# EAGLE design litefury5-final (EAGLE 6.5.0)
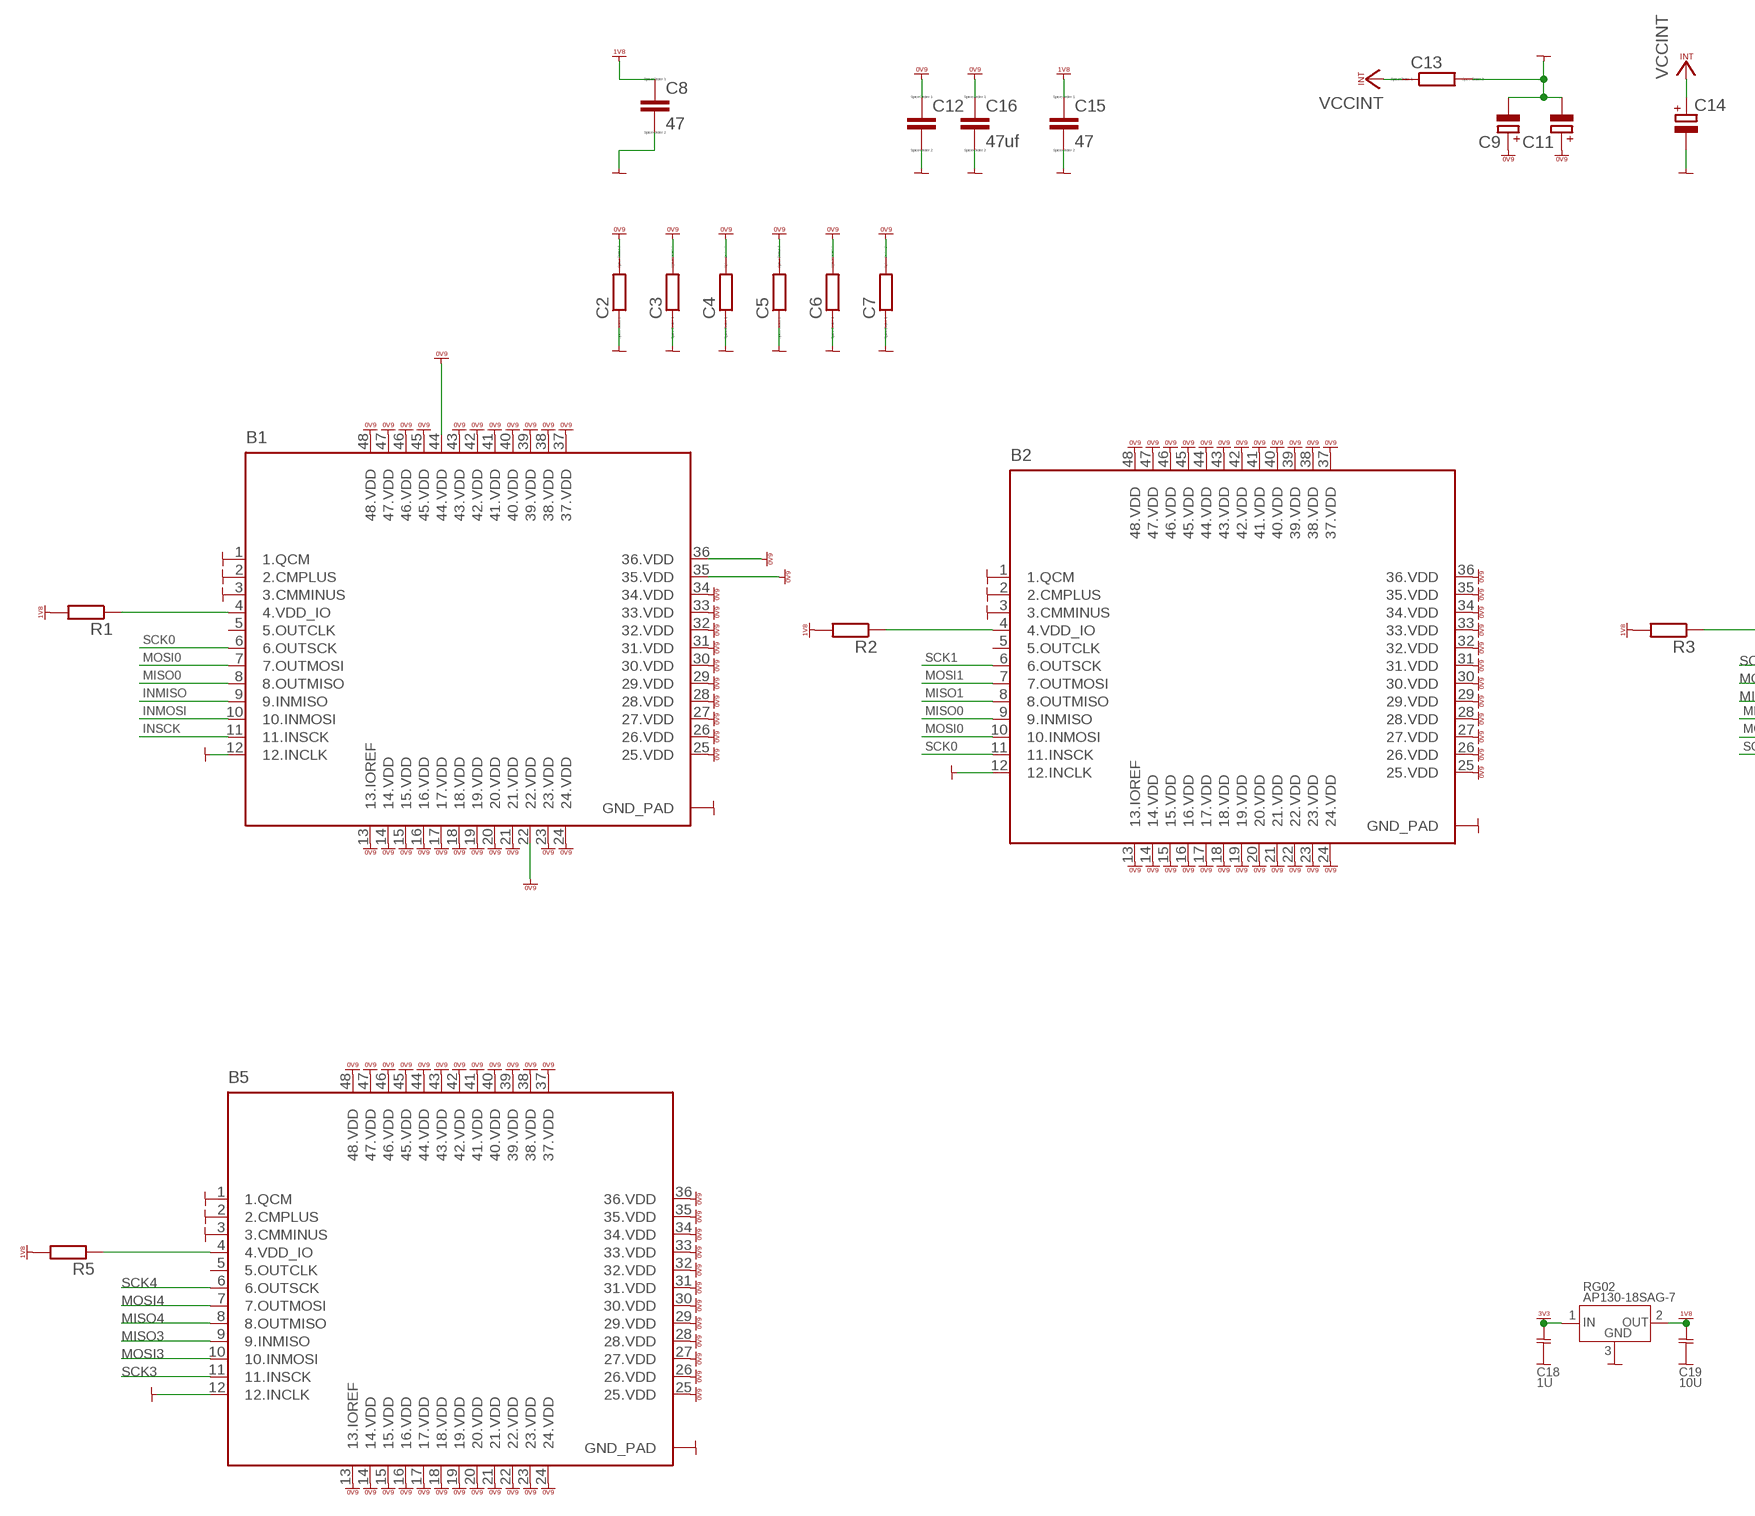
[diagram p0: schematic, sheet 1, part 1 of 2]
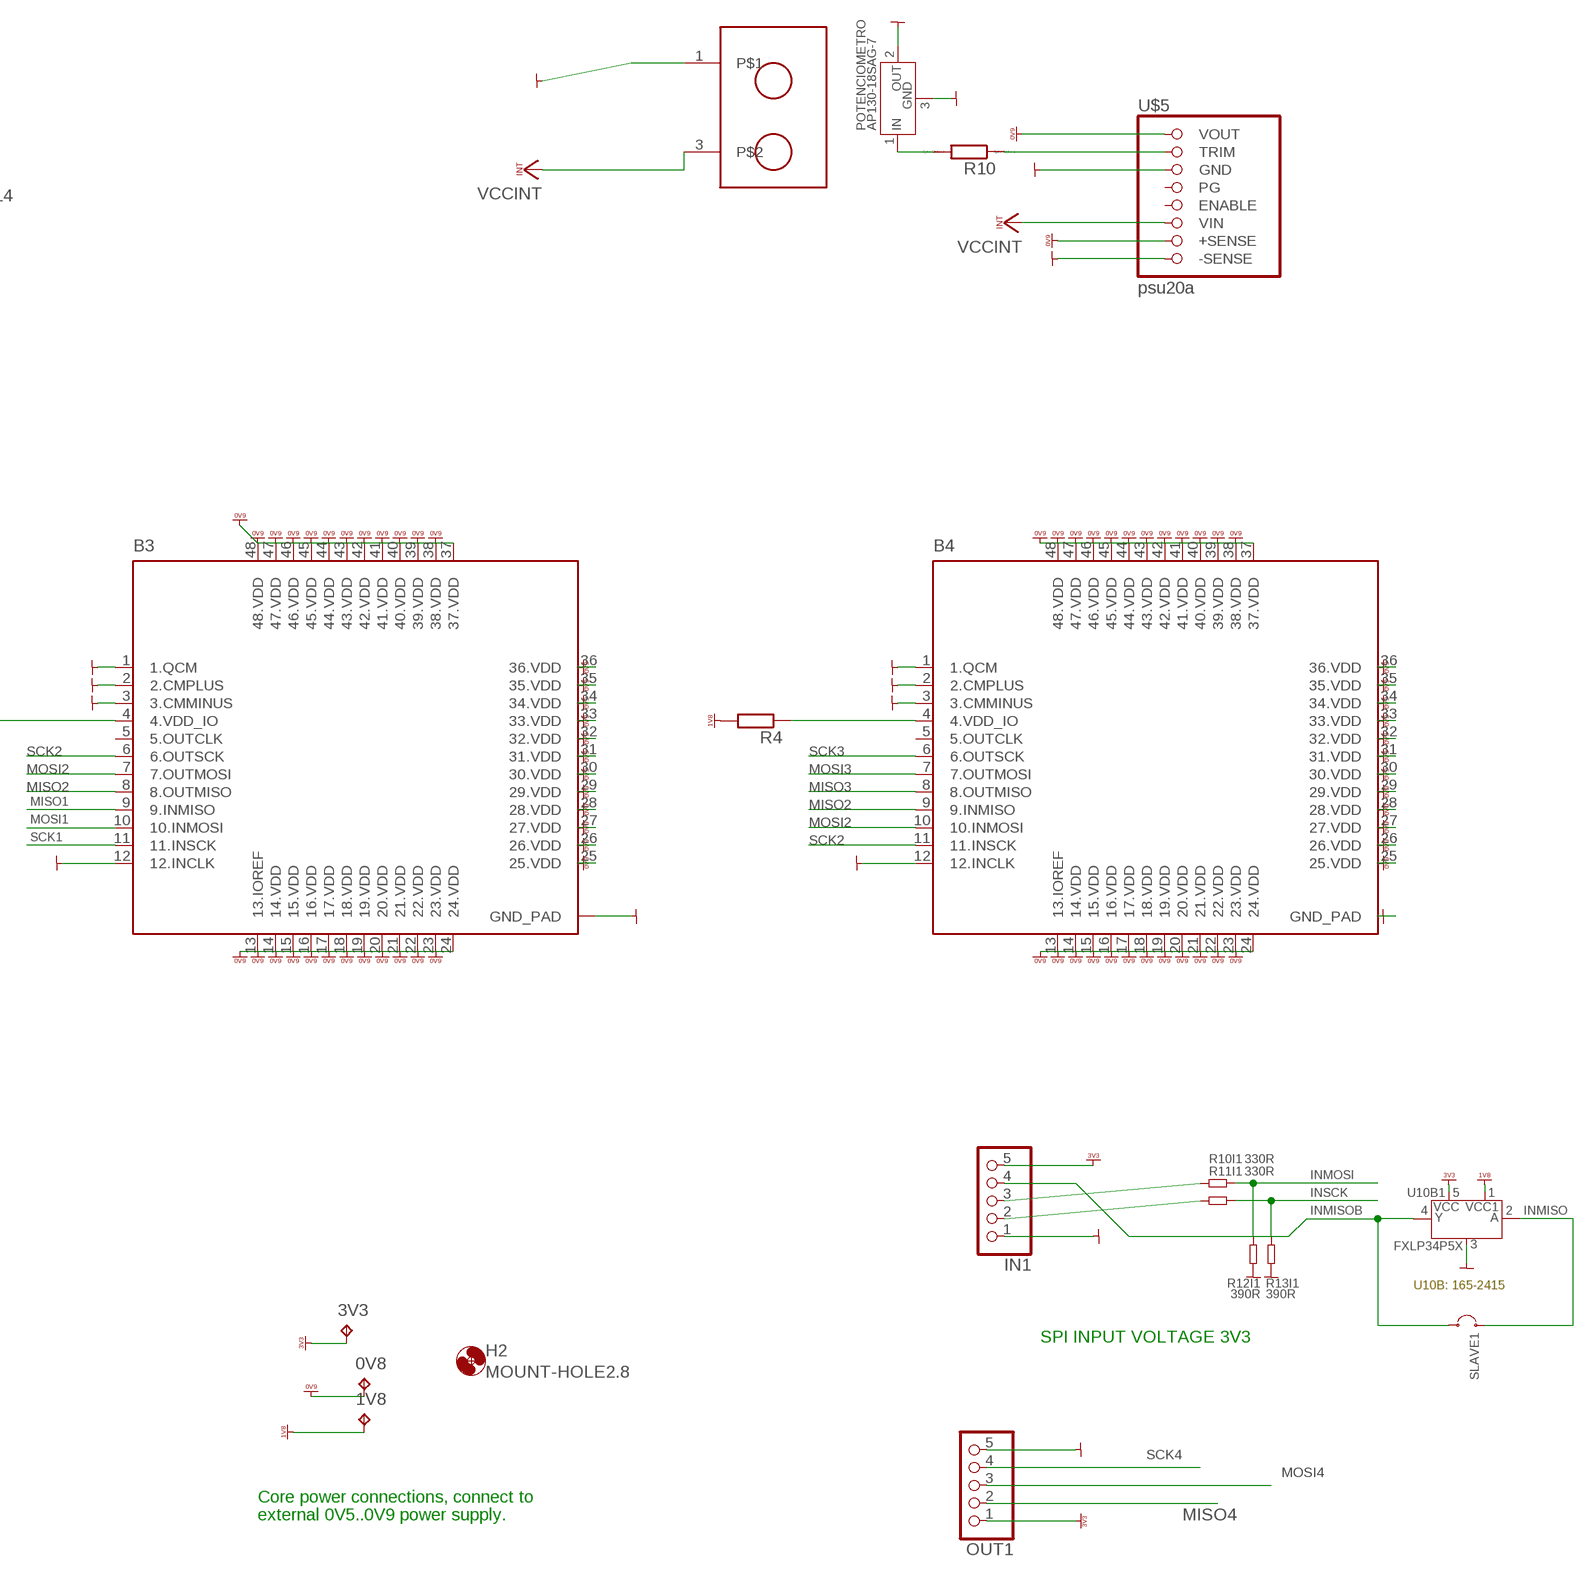
[diagram p1: schematic, sheet 1, part 2 of 2]

## Parts
0V8  TPTP14SQ  [TP14SQ]
1V8  TPTP10SQ  [TP10SQ]
3V3  TPTP14SQ  [TP14SQ]
B1  BITFURYM  [QFN48]
B2  BITFURYM  [QFN48]
B3  BITFURYM  [QFN48]
B4  BITFURYM  [QFN48]
B5  BITFURYM  [QFN48]
C2  RR2010  [R2010]
C3  RR2010  [R2010]
C4  RR2010  [R2010]
C5  RR2010  [R2010]
C6  RR2010  [R2010]
C7  RR2010  [R2010]
C8  47  CC1210  [C1210]
C9  CPOL-EUCT7343  [CT7343]
C11  CPOL-EUCT7343  [CT7343]
C12  CC1210  [C1210]
C13  RR2010  [R2010]
C14  CPOL-EUCT7343  [CT7343]
C15  47  CC1210  [C1210]
C16  47uf  CC1210  [C1210]
C18  1U  CAP0603  [CAP0603]
C19  10U  CAP0603  [CAP0603]
H2  MOUNT-HOLE2.8  [2,8]
IN1  PINHD-1X5/90  [1X05/90]
OUT1  PINHD-1X5/90  [1X05/90]
POTENCIOMETRO  AP130-18SAG-7  [SOT23]
R1  R-EU_R1206  [R1206]
R2  R-EU_R1206  [R1206]
R3  R-EU_R1206  [R1206]
R4  R-EU_R1206  [R1206]
R5  R-EU_R1206  [R1206]
R10  RR0603  [R0603]
R10I1  330R  RES0603  [RES0603]
R11I1  330R  RES0603  [RES0603]
R12I1  390R  RES0603  [RES0603]
R13I1  390R  RES0603  [RES0603]
RG02  AP130-18SAG-7  [SOT23]
SLAVE1  SJ2SJ2-S  [SJ2-S]
U10B1  FXLP34P5X  [SOT23-5]
U$5  D12S05020  [PSU20A]
U$6  RTORNILLO  [REGLETATORNILLO]

## Nets
GND: B1.1(1.QCM) B1.2(2.CMPLUS) B1.3(3.CMMINUS) B1.12(12.INCLK) B1.EXP(GND_PAD) B1.P$1(GND_PAD) B1.P$2(GND_PAD) B1.P$3(GND_PAD) B1.P$4(GND_PAD) B1.P$5(GND_PAD) B1.P$6(GND_PAD) B1.P$7(GND_PAD) B1.P$8(GND_PAD) B1.P$9(GND_PAD) B1.P$10(GND_PAD) B1.P$11(GND_PAD) B1.P$12(GND_PAD) B1.P$13(GND_PAD) B1.P$14(GND_PAD) B1.P$15(GND_PAD) B1.P$16(GND_PAD) B1.P$17(GND_PAD) B1.P$18(GND_PAD) B1.P$19(GND_PAD) B1.P$20(GND_PAD) B1.P$21(GND_PAD) B1.P$22(GND_PAD) B1.P$23(GND_PAD) B1.P$24(GND_PAD) B1.P$25(GND_PAD) B2.1(1.QCM) B2.2(2.CMPLUS) B2.3(3.CMMINUS) B2.12(12.INCLK) B2.EXP(GND_PAD) B2.P$1(GND_PAD) B2.P$2(GND_PAD) B2.P$3(GND_PAD) B2.P$4(GND_PAD) B2.P$5(GND_PAD) B2.P$6(GND_PAD) B2.P$7(GND_PAD) B2.P$8(GND_PAD) B2.P$9(GND_PAD) B2.P$10(GND_PAD) B2.P$11(GND_PAD) B2.P$12(GND_PAD) B2.P$13(GND_PAD) B2.P$14(GND_PAD) B2.P$15(GND_PAD) B2.P$16(GND_PAD) B2.P$17(GND_PAD) B2.P$18(GND_PAD) B2.P$19(GND_PAD) B2.P$20(GND_PAD) B2.P$21(GND_PAD) B2.P$22(GND_PAD) B2.P$23(GND_PAD) B2.P$24(GND_PAD) B2.P$25(GND_PAD) B3.1(1.QCM) B3.2(2.CMPLUS) B3.3(3.CMMINUS) B3.12(12.INCLK) B3.EXP(GND_PAD) B3.P$1(GND_PAD) B3.P$2(GND_PAD) B3.P$3(GND_PAD) B3.P$4(GND_PAD) B3.P$5(GND_PAD) B3.P$6(GND_PAD) B3.P$7(GND_PAD) B3.P$8(GND_PAD) B3.P$9(GND_PAD) B3.P$10(GND_PAD) B3.P$11(GND_PAD) B3.P$12(GND_PAD) B3.P$13(GND_PAD) B3.P$14(GND_PAD) B3.P$15(GND_PAD) B3.P$16(GND_PAD) B3.P$17(GND_PAD) B3.P$18(GND_PAD) B3.P$19(GND_PAD) B3.P$20(GND_PAD) B3.P$21(GND_PAD) B3.P$22(GND_PAD) B3.P$23(GND_PAD) B3.P$24(GND_PAD) B3.P$25(GND_PAD) B4.1(1.QCM) B4.2(2.CMPLUS) B4.3(3.CMMINUS) B4.12(12.INCLK) B4.EXP(GND_PAD) B4.P$1(GND_PAD) B4.P$2(GND_PAD) B4.P$3(GND_PAD) B4.P$4(GND_PAD) B4.P$5(GND_PAD) B4.P$6(GND_PAD) B4.P$7(GND_PAD) B4.P$8(GND_PAD) B4.P$9(GND_PAD) B4.P$10(GND_PAD) B4.P$11(GND_PAD) B4.P$12(GND_PAD) B4.P$13(GND_PAD) B4.P$14(GND_PAD) B4.P$15(GND_PAD) B4.P$16(GND_PAD) B4.P$17(GND_PAD) B4.P$18(GND_PAD) B4.P$19(GND_PAD) B4.P$20(GND_PAD) B4.P$21(GND_PAD) B4.P$22(GND_PAD) B4.P$23(GND_PAD) B4.P$24(GND_PAD) B4.P$25(GND_PAD) B5.1(1.QCM) B5.2(2.CMPLUS) B5.3(3.CMMINUS) B5.12(12.INCLK) B5.EXP(GND_PAD) B5.P$1(GND_PAD) B5.P$2(GND_PAD) B5.P$3(GND_PAD) B5.P$4(GND_PAD) B5.P$5(GND_PAD) B5.P$6(GND_PAD) B5.P$7(GND_PAD) B5.P$8(GND_PAD) B5.P$9(GND_PAD) B5.P$10(GND_PAD) B5.P$11(GND_PAD) B5.P$12(GND_PAD) B5.P$13(GND_PAD) B5.P$14(GND_PAD) B5.P$15(GND_PAD) B5.P$16(GND_PAD) B5.P$17(GND_PAD) B5.P$18(GND_PAD) B5.P$19(GND_PAD) B5.P$20(GND_PAD) B5.P$21(GND_PAD) B5.P$22(GND_PAD) B5.P$23(GND_PAD) B5.P$24(GND_PAD) B5.P$25(GND_PAD) C2.1 C3.1 C4.1 C5.1 C6.1 C7.1 C8.2 C9.- C11.- C12.2 C13.2 C14.- C15.2 C16.2 C18.2 C19.2 IN1.1 OUT1.5 POTENCIOMETRO.2(2.OUT) POTENCIOMETRO.3(3.GND) R12I1.1 R13I1.1 RG02.3(3.GND) U10B1.3(3.GND) U$5.3(GND) U$5.8(-SENSE) U$6.1
INMISO: B1.9(9.INMISO) SLAVE1.2 U10B1.2(2.A)
INMISOB: IN1.4 SLAVE1.1 U10B1.4(4.Y)
INMOSI: B1.10(10.INMOSI) R10I1.2 R12I1.2
INSCK: B1.11(11.INSCK) R11I1.2 R13I1.2
MISO0: B1.8(8.OUTMISO) B2.9(9.INMISO)
MISO1: B2.8(8.OUTMISO) B3.9(9.INMISO)
MISO2: B3.8(8.OUTMISO) B4.9(9.INMISO)
MISO3: B4.8(8.OUTMISO) B5.9(9.INMISO)
MISO4: B5.8(8.OUTMISO) OUT1.2
MOSI0: B1.7(7.OUTMOSI) B2.10(10.INMOSI)
MOSI1: B2.7(7.OUTMOSI) B3.10(10.INMOSI)
MOSI2: B3.7(7.OUTMOSI) B4.10(10.INMOSI)
MOSI3: B4.7(7.OUTMOSI) B5.10(10.INMOSI)
MOSI4: B5.7(7.OUTMOSI) OUT1.3
N$1: B1.4(4.VDD_IO) R1.1
N$2: B2.4(4.VDD_IO) R2.1
N$3: B3.4(4.VDD_IO) R3.1
N$4: B4.4(4.VDD_IO) R4.1
N$5: B5.4(4.VDD_IO) R5.1
N$6: POTENCIOMETRO.1(1.IN) R10.2
N$10: R10.1 U$5.2(TRIM)
N$12: IN1.2 R11I1.1
N$13: IN1.3 R10I1.1
SCK0: B1.6(6.OUTSCK) B2.11(11.INSCK)
SCK1: B2.6(6.OUTSCK) B3.11(11.INSCK)
SCK2: B3.6(6.OUTSCK) B4.11(11.INSCK)
SCK3: B4.6(6.OUTSCK) B5.11(11.INSCK)
SCK4: B5.6(6.OUTSCK) OUT1.4
VCCINT: C13.1 C14.+ U$5.6(VIN) U$6.3
VDD_0V9: 0V8.TP B1.13(13.IOREF) B1.14(14.VDD) B1.15(15.VDD) B1.16(16.VDD) B1.17(17.VDD) B1.18(18.VDD) B1.19(19.VDD) B1.20(20.VDD) B1.21(21.VDD) B1.22(22.VDD) B1.23(23.VDD) B1.24(24.VDD) B1.25(25.VDD) B1.26(26.VDD) B1.27(27.VDD) B1.28(28.VDD) B1.29(29.VDD) B1.30(30.VDD) B1.31(31.VDD) B1.32(32.VDD) B1.33(33.VDD) B1.34(34.VDD) B1.35(35.VDD) B1.36(36.VDD) B1.37(37.VDD) B1.38(38.VDD) B1.39(39.VDD) B1.40(40.VDD) B1.41(41.VDD) B1.42(42.VDD) B1.43(43.VDD) B1.44(44.VDD) B1.45(45.VDD) B1.46(46.VDD) B1.47(47.VDD) B1.48(48.VDD) B2.13(13.IOREF) B2.14(14.VDD) B2.15(15.VDD) B2.16(16.VDD) B2.17(17.VDD) B2.18(18.VDD) B2.19(19.VDD) B2.20(20.VDD) B2.21(21.VDD) B2.22(22.VDD) B2.23(23.VDD) B2.24(24.VDD) B2.25(25.VDD) B2.26(26.VDD) B2.27(27.VDD) B2.28(28.VDD) B2.29(29.VDD) B2.30(30.VDD) B2.31(31.VDD) B2.32(32.VDD) B2.33(33.VDD) B2.34(34.VDD) B2.35(35.VDD) B2.36(36.VDD) B2.37(37.VDD) B2.38(38.VDD) B2.39(39.VDD) B2.40(40.VDD) B2.41(41.VDD) B2.42(42.VDD) B2.43(43.VDD) B2.44(44.VDD) B2.45(45.VDD) B2.46(46.VDD) B2.47(47.VDD) B2.48(48.VDD) B3.13(13.IOREF) B3.14(14.VDD) B3.15(15.VDD) B3.16(16.VDD) B3.17(17.VDD) B3.18(18.VDD) B3.19(19.VDD) B3.20(20.VDD) B3.21(21.VDD) B3.22(22.VDD) B3.23(23.VDD) B3.24(24.VDD) B3.25(25.VDD) B3.26(26.VDD) B3.27(27.VDD) B3.28(28.VDD) B3.29(29.VDD) B3.30(30.VDD) B3.31(31.VDD) B3.32(32.VDD) B3.33(33.VDD) B3.34(34.VDD) B3.35(35.VDD) B3.36(36.VDD) B3.37(37.VDD) B3.38(38.VDD) B3.39(39.VDD) B3.40(40.VDD) B3.41(41.VDD) B3.42(42.VDD) B3.43(43.VDD) B3.44(44.VDD) B3.45(45.VDD) B3.46(46.VDD) B3.47(47.VDD) B3.48(48.VDD) B4.13(13.IOREF) B4.14(14.VDD) B4.15(15.VDD) B4.16(16.VDD) B4.17(17.VDD) B4.18(18.VDD) B4.19(19.VDD) B4.20(20.VDD) B4.21(21.VDD) B4.22(22.VDD) B4.23(23.VDD) B4.24(24.VDD) B4.25(25.VDD) B4.26(26.VDD) B4.27(27.VDD) B4.28(28.VDD) B4.29(29.VDD) B4.30(30.VDD) B4.31(31.VDD) B4.32(32.VDD) B4.33(33.VDD) B4.34(34.VDD) B4.35(35.VDD) B4.36(36.VDD) B4.37(37.VDD) B4.38(38.VDD) B4.39(39.VDD) B4.40(40.VDD) B4.41(41.VDD) B4.42(42.VDD) B4.43(43.VDD) B4.44(44.VDD) B4.45(45.VDD) B4.46(46.VDD) B4.47(47.VDD) B4.48(48.VDD) B5.13(13.IOREF) B5.14(14.VDD) B5.15(15.VDD) B5.16(16.VDD) B5.17(17.VDD) B5.18(18.VDD) B5.19(19.VDD) B5.20(20.VDD) B5.21(21.VDD) B5.22(22.VDD) B5.23(23.VDD) B5.24(24.VDD) B5.25(25.VDD) B5.26(26.VDD) B5.27(27.VDD) B5.28(28.VDD) B5.29(29.VDD) B5.30(30.VDD) B5.31(31.VDD) B5.32(32.VDD) B5.33(33.VDD) B5.34(34.VDD) B5.35(35.VDD) B5.36(36.VDD) B5.37(37.VDD) B5.38(38.VDD) B5.39(39.VDD) B5.40(40.VDD) B5.41(41.VDD) B5.42(42.VDD) B5.43(43.VDD) B5.44(44.VDD) B5.45(45.VDD) B5.46(46.VDD) B5.47(47.VDD) B5.48(48.VDD) C2.2 C3.2 C4.2 C5.2 C6.2 C7.2 C9.+ C11.+ C12.1 C16.1 U$5.1(VOUT) U$5.7(+SENSE) ; supply symbol labelled VCC_0V9
VDD_1V8: 1V8.TP C8.1 C15.1 C19.1 R1.2 R2.2 R3.2 R4.2 R5.2 RG02.2(2.OUT) U10B1.1(1.VCC1) ; supply symbol labelled VCC_1V8
VDD_3V3: 3V3.TP C18.1 IN1.5 OUT1.1 RG02.1(1.IN) U10B1.5(5.VCC) ; supply symbol labelled VCC_3V3
Unconnected: B1.5(5.OUTCLK) B2.5(5.OUTCLK) B3.5(5.OUTCLK) B4.5(5.OUTCLK) B5.5(5.OUTCLK) U$5.4(PG) U$5.5(ENABLE)

## Notes on the sheet
- U10B: 165-2415
- SPI INPUT VOLTAGE 3V3
- Core power connections, connect to
- external 0V5..0V9 power supply.

## Library data of the parts
0V8 1V8 3V3 = testpad:TP: Test pad
B1-B5 = BITF:BITFURYM
C2-C7 C13 R10 = eagle-ltspice:R: RESISTOR, European symbol; SPICEMODEL: NONE; SPICEPREFIX: R
C8 C12 C15 C16 = eagle-ltspice:C: CAPACITOR, European symbol; SPICEMODEL: NONE; SPICEPREFIX: C
C9 C11 C14 = rcl:CPOL-EU: POLARIZED CAPACITOR, European symbol
C18 C19 = 00-own_parts:CAP0603
H2 = holes:MOUNT-HOLE: MOUNTING HOLE with drill center marker
IN1 OUT1 = pinhead:PINHD-1X5: PIN HEADER
POTENCIOMETRO RG02 = 00-bitfury:AP130-18SAG-7: Regulator, 300mA, Vdrop: 400mV, Vin_max: 5V5, Vout: 1V8, SOT23, F#182-5304
R1-R5 = rcl:R-EU_: RESISTOR, European symbol
R10I1 R11I1 R12I1 R13I1 = 00-own_parts:RES
SLAVE1 = 00-own_parts:SJ2
U10B1 = 00-bitfury:FXLP34P5X: Buffer, level shifting, single gate, SOT23-5, F#165-2415
U$5 = BITF:D12S05020
U$6 = BITF:RTORNILLO

## Board
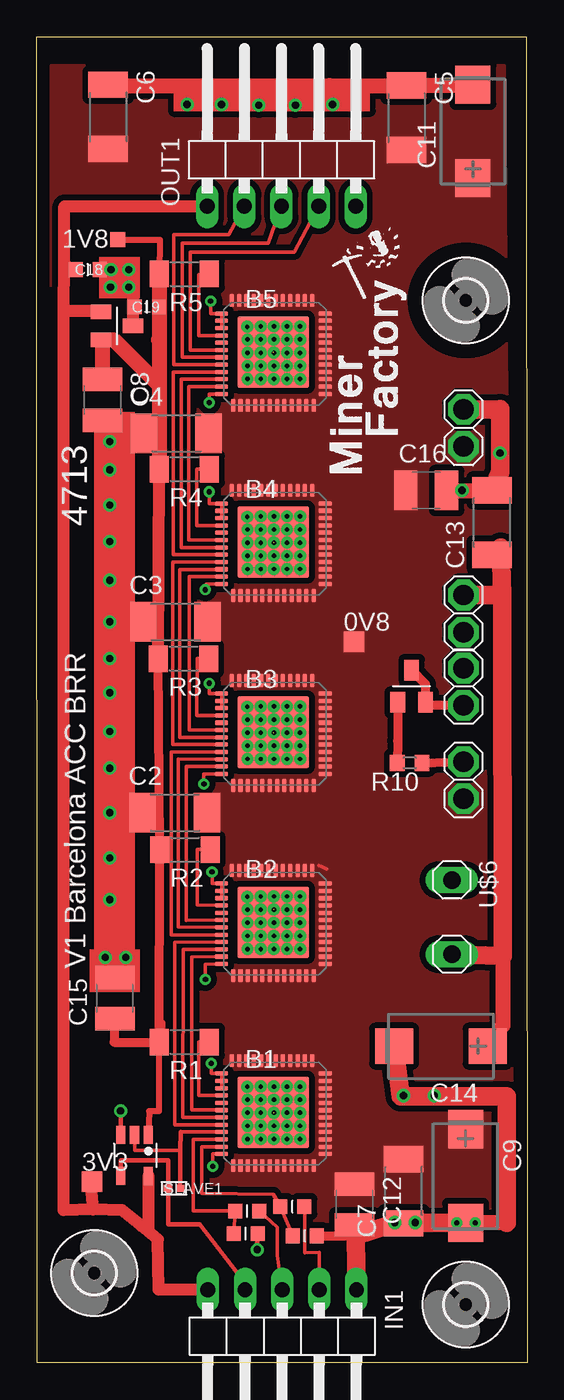
[diagram p2: board, top side]
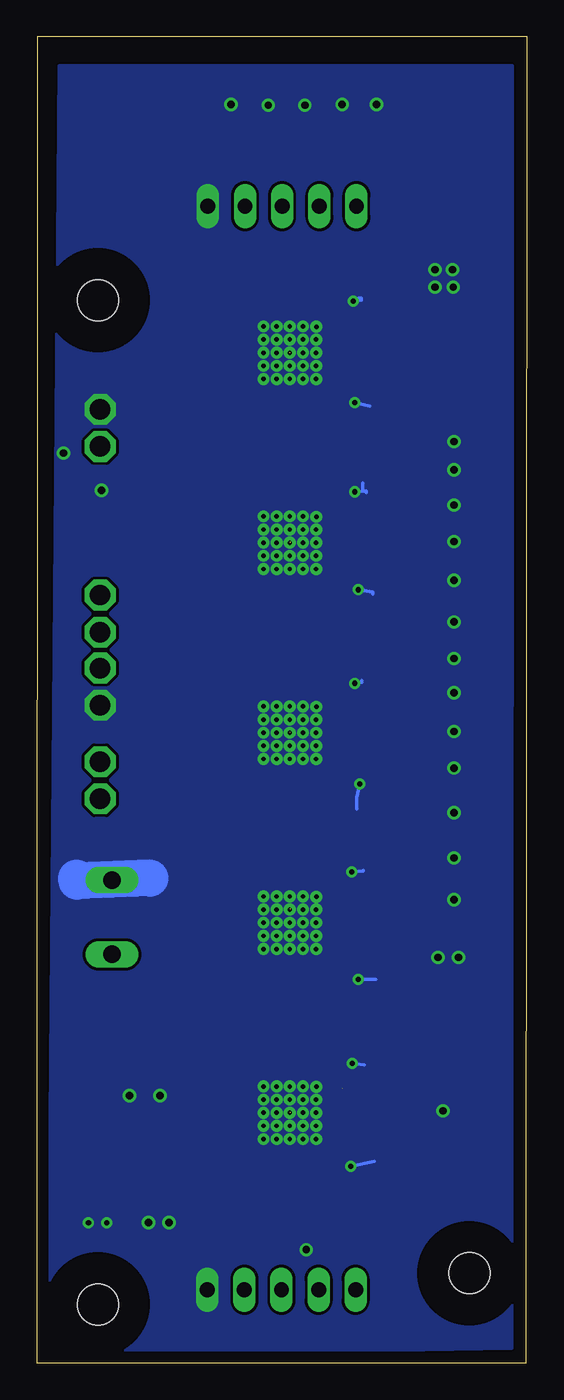
[diagram p3: board, bottom side, seen from below]

Size 33.55 x 90.75 mm. Coordinates in mm from the lower left corner, seen from the top.
Outline: 0,90.75 33.5,90.75 33.55,0 0.05,0 0,90.75
Copper layers (1*16): Top 0.035mm / dielectric 1.5mm / Bottom 0.035mm
Design rules "default *": minimum track width 10mil, minimum drill 24mil, track to track 8mil, track to pad 8mil, pad to pad 8mil, via to via 8mil, smd to smd 8mil, copper to edge 30mil, drill to drill 12mil, minimum pad ring 10mil, minimum via ring 8mil, stop-mask expansion 4mil, vias tented up to drill 0mil, thermal gap 10mil

### Footprints (pad centres in the part's own frame; a part is rotated, then mirrored left to right if it is on the bottom)
TP14SQ = smd 1.4 x 1.4: TP 0,0
TP10SQ = smd 1 x 1: TP 0,0
QFN48 = smd 0.889 x 0.3: 1 3.645,-2.75; 2 3.645,-2.25; 3 3.645,-1.75; 4 3.645,-1.25; 5 3.645,-0.75; 6 3.645,-0.25; 7 3.645,0.25; 8 3.645,0.75; 9 3.645,1.25; 10 3.645,1.75; 11 3.645,2.25; 12 3.645,2.75; 25 -3.444,2.75; 26 -3.444,2.25; 27 -3.444,1.75; 28 -3.444,1.25; 29 -3.444,0.75; 30 -3.444,0.25; 31 -3.444,-0.25; 32 -3.444,-0.75; 33 -3.444,-1.25; 34 -3.444,-1.75; 35 -3.444,-2.25; 36 -3.444,-2.75 | smd 0.3 x 0.889: 13 2.85,3.544; 14 2.35,3.544; 15 1.85,3.544; 16 1.35,3.544; 17 0.85,3.544; 18 0.35,3.544; 19 -0.15,3.544; 20 -0.65,3.544; 21 -1.15,3.544; 22 -1.65,3.544; 23 -2.15,3.544; 24 -2.65,3.544; 37 -2.55,-3.644; 38 -2.05,-3.644; 39 -1.55,-3.644; 40 -1.05,-3.644; 41 -0.55,-3.644; 42 -0.05,-3.644; 43 0.45,-3.644; 44 0.95,-3.644; 45 1.45,-3.644; 46 1.95,-3.644; 47 2.45,-3.644; 48 2.95,-3.644 | smd 4.9 x 4.9: EXP 0.1,-0.1 | drill 0.3: P$1 1.887,-1.845; P$2 0.97,-1.87; P$3 0.07,-1.87; P$4 -0.83,-1.87; P$5 -1.73,-1.87; P$6 1.87,-0.97; P$7 0.97,-0.97; P$8 0.07,-0.97; P$9 -0.83,-0.97; P$10 -1.73,-0.97; P$11 1.87,-0.07; P$12 0.97,-0.07; P$13 0.07,-0.07; P$14 -0.83,-0.07; P$15 -1.73,-0.07; P$16 1.87,0.83; P$17 0.97,0.83; P$18 0.07,0.83; P$19 -0.83,0.83; P$20 -1.73,0.83; P$21 1.87,1.73; P$22 0.97,1.73; P$23 0.07,1.73; P$24 -0.83,1.73; P$25 -1.73,1.73
R2010 = smd 1.8 x 2.7: 1 -2.2,0; 2 2.2,0
C1210 = smd 1.6 x 2.7: 1 -1.4,0; 2 1.4,0
CT7343 = smd 2.6 x 2.4: + -3.2,0; - 3.2,0
CAP0603 = smd 0.95 x 1: 1 -0.821,0.002; 2 0.822,0
2,8 = hole 2.8: 0,0
1X05/90 = drill 1.016 long: 1 -5.08,-3.81; 2 -2.54,-3.81; 3 0,-3.81; 4 2.54,-3.81; 5 5.08,-3.81
SOT23 = smd 1 x 1.4: 1 -0.95,-1.1; 2 0.95,-1.1; 3 0,1.1
R1206 = smd 1.3 x 1.803: 1 -1.722,0; 2 1.722,0
R0603 = smd 1 x 1.1: 1 -0.85,0; 2 0.85,0
RES0603 = smd 0.95 x 1: 1 -0.821,0.002; 2 0.822,0
SJ2-S = smd 0.6 x 0.5: 1 -0.41,0; 2 0.41,0
SOT23-5 = smd 0.62 x 1.22: 1 -0.95,-1.4; 2 0,-1.4; 3 0.95,-1.4; 4 0.95,1.4; 5 -0.95,1.4
PSU20A = drill 1.4 octagon: 1 12.5,0.1; 2 9.96,0.1; 3 6.1,0.1; 4 3.56,0.1; 5 1.1,0.1; 6 -1.44,0.1; 7 -11.6,0.1; 8 -14.14,0.1
REGLETATORNILLO = drill 1.2 long: 1 -2.54,0; 3 2.54,0

### Placement (x,y rotation side)
0V8  21.7,49.35 0 top
1V8  5.55,76.85 0 top
3V3  3.8,12.4 0 top
B1  16.3,17.05 180 top
B2  16.3,30.05 180 top
B3  16.3,43.05 180 top
B4  16.3,56.05 180 top
B5  16.3,69.05 180 top
C2  9.45,37.65 0 top
C3  9.5,50.7 0 top
C4  9.55,63.6 0 top
C5  25.3,85.2 270 top
C6  4.9,85.25 270 top
C7  25.1,11.75 90 top
C8  4.5,65.9 270 top
C9  29.34,12.8 270 top
C11  29.84,84.25 90 top
C12  21.75,10.85 270 top
C13  31.15,57.5 90 top
C14  27.65,21.68 180 top
C15  5.35,24.95 90 top
C16  26.65,59.7 0 top
C18  3.5,74.8 0 top
C19  7.55,72.25 180 top
H1  MOUNT-HOLE2.8  [2,8]  29.35,72.7 0 top
H2  3.95,6.15 0 top
H4  MOUNT-HOLE2.8  [2,8]  29.35,4 0 top
IN1  16.8,1.2 180 top
OUT1  16.75,82.95 0 top
POTENCIOMETRO  25.65,46.3 0 top
R1  10.1,21.96 180 top
R2  10.15,35.12 180 top
R3  10.05,48.19 180 top
R4  10.1,61.15 180 top
R5  10.1,74.5 180 top
R10  25.52,41.06 180 top
R10I1  14.4,10.4 180 top
R11I1  17.5,10.7 180 top
R12I1  14.3,8.85 180 top
R13I1  18.35,8.7 180 top
RG02  5.5,70.95 270 top
SLAVE1  9.4,11.95 0 top
U10B1  6.7,14.2 180 top
U$5  29.1,51.1 270 top
U$6  28.4,30.5 270 top
U$37  [MINERFACTORY]  25.4,60.6 90 top

### Tracks (layer width: path | path; a pad name or v marks a point on that pad's centre or on a via)
GND  (via drill 0.35, 0.5)  (6 unrouted)
  Top 0.254: B2.12 11.55,27.28 v11.55,26.25 | B1.12 12.05,14.3 v12.05,13.45 | 14.8,31.13 15.3,31.1 16.2,31.05 B2.EXP | B3.12 11.45,40.31 v11.45,39.6 | B4.3 B4.2 B4.1 11.8,58.8 v11.8,59.6 | v11.8,46.5 11.8,45.8 B3.1 B3.2 B3.3 | B4.12 11.6,53.3 v11.55,52.9 | v11.9,72.65 11.9,71.8 B5.1 B5.2 B5.3 | B5.12 11.8,66.3 v11.8,65.7 | v12,33.6 12,32.8 B2.1 B2.2 B2.3 | C19.2 6.35,70.95 v6.3,73.6 | v11.95,20.5 11.95,19.85 arc90 12,19.8 B1.1 B1.2 | 12.6,18.8 B1.3 B1.2 | B1.2
  Top 0.305: v6.1,27.75 6.1,26.35 C15.2 | v20.25,86.1 20.05,87.4 | v17.7,86.05 17.7,87.45 | v15.2,86.05 15.2,87.3 | v12.65,86.1 12.65,87.25 | v10.3,86.1 10.3,87.3 | R12I1.1 15.1,8.83 v15.1,7.75 | U10B1.3 v5.75,17.25
  Top 0.406: C2.1 v5,37.65 | C18.2 v5.1,74.8 | C8.2 arc-90 5,64 v5,63.04
  Top 0.61: C3.1 v5,50.7 | v5,63.04 C4.1 7.4,63.65 | R13I1.1 21.83,8.69 | 24.14,9.45 25.25,9.45 | 25.75,9.6 25.6,9.45 25.25,9.45 | C7.1 25.25,9.45 | C11.- 29.84,87.4 | C6.1 5,87.4 | 29,45.2 U$5.3 26.8,45 POTENCIOMETRO.2 26.6,46.45 POTENCIOMETRO.3
  Top 0.813: RG02.3 6.6,73.6 v6.3,73.6
  Top 1.016: 29.84,87.4 C5.1 20.05,87.4 5,87.4 | C12.2 21.86,9.34 21.86,6.5 | C16.2 C13.2 | 32.15,9.6 v30,9.6
  Top 1.27: IN1.1 21.86,6.5 21.83,8.69 24.14,9.45 | 25.75,9.6 C9.- | C13.2 31.7,60.95 31.7,65.25 31.69,65.24 U$5.8 | C14.- 24.9,18.25 32.15,18.25 32.15,9.6
  Bottom 0.254: v12.05,13.45 10.45,13.8 | v11.45,39.6 11.65,38.7 11.65,37.9 | v11.8,59.6 11,59.65 | 11,59.55 11,59.65 | 11,59.65 11.25,59.65 11.25,60.2 | v11.8,46.5 11.3,46.55 11.3,46.7 | v11.55,52.9 10.55,52.75 10.55,52.6 | v11.9,72.65 11.35,72.7 11.35,72.85 11.5,72.85 11.5,72.8 | v11.8,65.7 10.75,65.45 | v12,33.6 11.2,33.65 | 11.25,33.65 11.2,33.65 | 11.2,33.65 11.2,33.7 | v11.55,26.25 10.35,26.25 | v11.95,20.5 11.15,20.4
  Bottom 2.54: 25.81,33.17 30.78,32.97 30.84,33.17
  other vias: 5.05,73.6 6.3,74.8 4.7,27.75 5,34.55 5,31.7 5,58.7 5,56.2 5,53.55 5,45.85 5,43.2 5,40.7 5,48.2 5,61.1 28.75,9.6 25.9,9.6 24.5,9.6 29.1,59.7 31.7,62.25 25.1,18.3 27.2,18.3
  pour Bottom (no thermals): 1.05,1 1,88.75 32,88.75 32.75,0.45
INMISO
  Top 0.254: 9.85,15.8 B1.9 | U10B1.2 6.7,14.55 9.83,14.55
  Top 0.305: 9.85,15.8 9.83,14.55 9.83,12.56 SLAVE1.2
INMISOB
  Top 0.305: U10B1.4 5.75,13.85 9,13.85 SLAVE1.1 | SLAVE1.1 | SLAVE1.1 9,9.5 11.15,9.5 14.26,5.44 IN1.4
INMOSI
  Top 0.254: B1.10 10.7,15.3 10.7,10.4 R10I1.2 R12I1.2
INSCK
  Top 0.254: B1.11 11.3,14.8 11.3,11.6 16.2,11.55 16.65,10.75 R11I1.2 R13I1.2
MISO0
  Top 0.254: B1.8 9.45,16.3 9.45,28.78 B2.9
MISO1
  Top 0.254: B2.8 9.2,29.28 9.2,41.81 B3.9
MISO2
  Top 0.254: B3.8 9.32,42.3 9.32,54.8 B4.9
MISO3
  Top 0.254: B4.8 9.35,55.3 9.35,67.8 B5.9
MISO4
  Top 0.254: B5.8 9.4,68.3 9.4,77.2 13.16,77.2 OUT1.2
MOSI0
  Top 0.254: B1.7 10,16.8 10.05,28.28 B2.10
MOSI1
  Top 0.254: B2.7 9.7,29.83 9.7,41.31 B3.10
MOSI2
  Top 0.254: B3.7 9.8,42.8 9.8,54.3 B4.10
MOSI3
  Top 0.254: B4.7 9.9,55.8 9.9,67.3 B5.10
MOSI4
  Top 0.254: B5.7 9.95,68.8 9.95,76.6 15.85,76.6 OUT1.3
N$1
  Top 0.254: B1.4 11.1,18.3 11.1,21.98 R1.1
N$2
  Top 0.254: B2.4 11,31.33 11,35.12 R2.1
N$3
  Top 0.254: B3.4 10.95,44.31 11,48.19 R3.1
N$4
  Top 0.254: B4.4 10.95,57.3 10.95,61.15 R4.1
N$5
  Top 0.254: B5.4 11.1,70.3 11.1,74.45 11.52,74.45 R5.1
N$6
  Top 0.61: POTENCIOMETRO.1 24.7,42.58 R10.2
N$10
  Top 0.61: R10.1 U$5.2
N$12
  Top 0.254: IN1.2 19.34,7.56 18.35,7.55 18.35,10.4
  Top 0.305: 18.35,10.4 R11I1.1
N$13
  Top 0.254: R10I1.1 16.45,9.27 16.45,7.35 IN1.3
SCK0
  Top 0.254: B1.6 10.6,17.3 10.6,27.78 B2.11
SCK1
  Top 0.254: B2.6 10.25,30.28 10.25,40.81 B3.11
SCK2
  Top 0.254: B3.6 10.45,43.3 10.45,53.8 B4.11
SCK3
  Top 0.254: B4.6 10.4,56.3 10.4,66.8 B5.11
SCK4
  Top 0.254: B5.6 10.5,69.3 10.5,76 17.64,76 OUT1.4
VCCINT
  Top 1.016: 31.9,27.86 31.9,23.08 C14.+
  Top 1.27: U$6.3 31.9,27.86 31.85,52.55 | 31.85,52.55 U$5.6 | C13.1 31.75,55.8 31.85,52.55
VDD_0V9
  Top 0.254: 19.85,33.8 19.3,34.05
  pour Top (isolate 0.406, no thermals): 1.05,1 1,88.75 32,88.75 32.65,0.55
VDD_1V8
  Top 0.254: C19.1 R5.2
  Top 0.305: C15.1 5.3,23.5 | 8.65,21.95 8.65,23.3 8.6,23.25 8.6,21.95
  Top 0.406: R1.2 8.38,17.22 7.7,17.22 U10B1.1 | 1V8.TP 8.43,76.85 R5.2 | 4.5,70 RG02.2
  Top 0.61: R3.2 R2.2 R1.2 8.68,21.95 8.65,21.95 8.6,21.95 5.3,21.95 5.3,23.5
  Top 0.813: R3.2 R4.2
  Top 1.016: R5.2 8.38,69.95 | 8.38,69.95 8.38,66.9 | 8.38,66.9 R4.2 | 8.33,70 8.38,69.95 | C8.1 4.5,70 5.28,70 8.38,66.9
VDD_3V3
  Top 0.406: C18.1 1.9,75.3
  Top 0.813: IN1.5 8.35,5.01 8.3,8.45 7.18,9.38 | 7.18,9.38 5.85,10.45 3.85,10.5 | 1.85,71.95 1.85,10.45 3.85,10.5 | 1.85,71.95 1.9,75.3 1.9,79.14 OUT1.1 | RG02.1 4.4,71.95 1.85,71.95 | U10B1.5 7.65,9.22 7.18,9.38 | 3V3.TP 3.7,12.05 3.85,10.5
(copper drawn outside any net)
  shapes: Top area x4

### Text on the board
tNames: 4713 | V1 Barcelona ACC BRR
tDocu: - | +